# Altium schematic sheet GPIO_CAN.SchDoc
size A; SheetNumber: 9; SheetTotal: 10
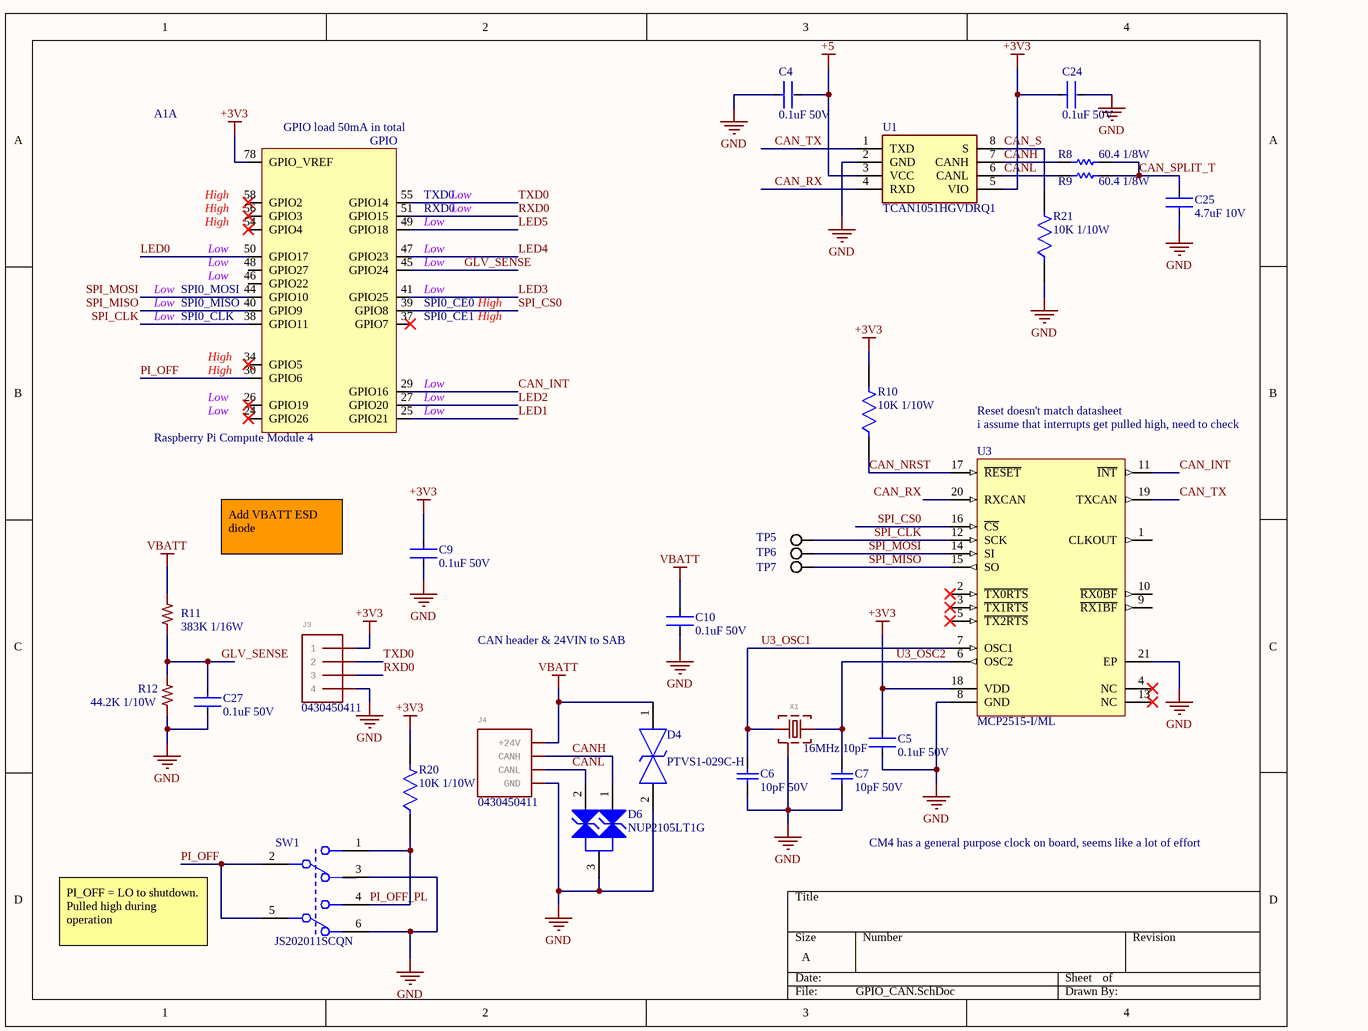
[diagram p0: GPIO_CAN.SchDoc]

## Parts
A1  Raspberry Pi Compute Module 4  [CM4-F40C-100DS-0.4v_1.5mm_0mm]  (part A of 21)  (no BOM)
C4  0.1uF 50V  [CAPACITOR_0603]
C5  0.1uF 50V  [CAPACITOR_0603]
C6  10pF 50V  [CAPC1608X90X40ML10T20]
C7  10pF 50V  [CAPC1608X90X40ML10T20]
C9  0.1uF 50V  [CAPACITOR_0603]
C10  0.1uF 50V  [CAPACITOR_0603]
C24  0.1uF 50V  [CAPACITOR_0603]
C25  4.7uF 10V  [CAPACITOR_0603]
C27  0.1uF 50V  [CAPACITOR_0603]
D4  PTVS1-029C-H  [PTVS1029CH]
D6  NUP2105LT1G  [ONSC-SOT-23-3-318-08_V]
J3  MPN: 0430450411  [43045-04YY_09101192]  (hidden comment: 4 Pin Connector)
J4  MPN: 0430450411  [43045-04YY_09101192]  (hidden comment: HyTech CAN Connector)
R8  60.4 1/8W  [RESC1608X55X30ML20T10]
R9  60.4 1/8W  [RESC1608X55X30ML20T10]
R10  10K 1/10W  [0603R]
R11  383K 1/16W  [0402R]
R12  44.2K 1/10W  [0402R]
R20  10K 1/10W  [0603R]
R21  10K 1/10W  [0603R]
SW1  JS202011SCQN  [FP-JS202011SCQN-MFG]
TP5  5019  [KSTN-5019_V]  (value not drawn)
TP6  5019  [KSTN-5019_V]  (value not drawn)
TP7  5019  [KSTN-5019_V]  (value not drawn)
U1  TCAN1051HGVDRQ1  [SOIC127P600X175-8N]
U3  MCP2515-I/ML  [QFN-ML20_L]
X1  16MHz 10pF  [XTAL_ECS-160-10-42-CKM-TR]

## Nets
+3V3: A1.78(GPIO_VREF) C5.2 C9.2 C24.2 J3.1 R10.2 R20.2 U1.5(VIO) U3.18(VDD)
+5: C4.1 U1.3(VCC)
GND: C4.2 C5.1 C6.1 C7.1 C9.1 C10.1 C24.1 C25.1 C27.1 D4.2 D6.3(K) J3.4 J4.2(GND) R12.1 R21.1 SW1.3 SW1.6 U1.2(GND) U3.8(GND) U3.21(EP) X1.2,4(GND)
VBATT: C10.2 D4.1 J4.1(+24V) R11.2
CAN_INT: A1.29(GPIO16) U3.11(~{INT})
CAN_NRST: R10.1 U3.17(~{RESET})
CAN_RX: U1.4(RXD) U3.20(RXCAN)
CAN_S: R21.2 U1.8(S)
CAN_SPLIT_T: C25.2 R8.2 R9.2
CAN_TX: U1.1(TXD) U3.19(TXCAN)
CANH: D6.1(K) J4.4(CANH) R8.1 U1.7(CANH)
CANL: D6.2(K) J4.3(CANL) R9.1 U1.6(CANL)
GLV_SENSE: A1.45(GPIO24) C27.2 R11.1 R12.2
LED0: A1.50(GPIO17)
LED1: A1.25(GPIO21)
LED2: A1.27(GPIO20)
LED3: A1.41(GPIO25)
LED4: A1.47(GPIO23)
LED5: A1.49(GPIO18)
PI_OFF: A1.30(GPIO6) SW1.2 SW1.5
PI_OFF_PL: R20.1 SW1.1 SW1.4
RXD0: A1.51(GPIO15) J3.3
SPI_CLK: A1.38(GPIO11) TP5.1 U3.12(SCK)
SPI_CS0: A1.39(GPIO8) U3.16(~{CS})
SPI_MISO: A1.40(GPIO9) TP7.1 U3.15(SO)
SPI_MOSI: A1.44(GPIO10) TP6.1 U3.14(SI)
TXD0: A1.55(GPIO14) J3.2
U3_OSC1: C6.2 U3.7(OSC1) X1.1
U3_OSC2: C7.2 U3.6(OSC2) X1.3

Not connected (* = marked no-connect by the designer): A1 24(GPIO26)* 26(GPIO19)* 34(GPIO5)* 37(GPIO7)* 46(GPIO22) 48(GPIO27) 54(GPIO4)* 56(GPIO3)* 58(GPIO2)*; U3 1(CLKOUT) 2(~{TX0RTS})* 3(~{TX1RTS})* 4(NC)* 5(~{TX2RTS})* 9(~{RX1BF}) 10(~{RX0BF}) 13(NC)*

## Notes on the sheet
- Reset doesn't match datasheet
- (near U3) i assume that interrupts get pulled high, need to check
- Add VBATT ESD diode
- (near C10) CAN header & 24VIN to SAB
- CM4 has a general purpose clock on board, seems like a lot of effort
- PI_OFF = LO to shutdown. Pulled high during operation
- (in symbol CM4, part A) GPIO load 50mA in total; GPIO; High; TXD0; Low; RXD0; SPI0_MOSI; SPI0_MISO; SPI0_CE0; SPI0_CLK; SPI0_CE1; by Amornthep Phunsin

## Library data of the parts
A1 = CM4: Raspberry Pi Compute Module 4 by Amornthep Phunsin; MPN: SC0695; MFR: Raspberry Pi
C4 C5 C9 C10 C24 C27 = CL10B104KB8NNWC: CAP CER 0.1UF 50V X7R 0603; MFR: Samsung Electro-Mechanics; MPN: CL10B104KB8NNWC
C6 C7 = CMP-2100-03593-1: Chip Capacitor, 10 pF, +/- 5%, 50 V, -55 to 125 degC, 0603 (1608 Metric), RoHS, Tape and Reel; Manufacturer: Yageo; MPN: CC0603JRNPO9BN100; Insulation Resistance: 100GR; Temperature Coefficient: 30ppm/degC; Dielectric: C0G; Radiation Hardening: No; Mount: SurfaceMount; Width: 0.031inch; Composition: Ceramic; Package Description: 2-Pin Surface Mount Device, Body 1.6 x 0.8 mm; Min Operating Temperature: -55degC; Case Code (Metric): 1608; Datasheet URL: http://www.yageo.com/documents/recent/UPY-GP_NP0_16V-to-50V_14.pdf; Voltage Rating: 50V; Termination: SMD/SMT; REACH SVHC: NoSVHC; Case/Package: 0603; RoHSCompliant: True; Packaging: TapeandReel; Max Operating Temperature: 125degC; Voltage: 50V; Package Quantity: 1; Manufacturer URL: http://www.yageo.com/; Tolerance: 5%; Capacitance: 10pF; Height: 0.8mm; Depth: 0.8mm; Thickness: 0.035inch; Case Code (Imperial): 0603; Length: 1.6mm; Package Reference: 0603; Voltage Rating (DC): 50V; Lead Free: LeadFree; Number of Pins: 2; Datasheet Version: Rev. 14, 07/2016; MFR: YAGEO
C25 = CL10A475KP8NNNC: CAP CER 4.7UF 10V X5R 0603; MFR: Samsung Electro-Mechanics; MPN: CL10A475KP8NNNC
D4 = PTVS1-029C-H: TVS Diode (Bi-directional); Manufacturer_Name: Bourns; Datasheet Link: https://g.componentsearchengine.com/Datasheets/0/16509875.pdf; Height: 2.6mm; Mouser Part Number: 652-PTVS1-029C-H; Mouser Price/Stock: https://www.mouser.co.uk/ProductDetail/Bourns/PTVS1-029C-H?qs=vvQtp7zwQdNgKzZ3txsBHg%3D%3D; Arrow Part Number: PTVS1-029C-H; MPN: PTVS1-029C-H; MFR: Bourns
D6 = NUP2105LT1G: Dual Line CAN Bus Protector, 3-Pin SOT-23, Pb-Free, Tape and Reel; MFR: On Semiconductor; IR Max (uA): 0.1; Number of Lines: 2; Direction: Bidirectional; PPK Max (W): 350; V(BR) Min (V): 26.2; ComponentLink3URL: http://www.onsemi.cn/pub_link/Collateral/318-08.PDF; Mounting Technology: Surface Mount; ComponentLink2Description: Datasheet; MPN: NUP2105LT1G; ComponentLink1URL: http://www.onsemi.com/; PackageVersion: Rev. AP, 11/2009; DatasheetVersion: Rev. 5; RoHS: Pb-Free; PackageReference: SOT-23-3-318-08; ComponentLink2URL: http://www.onsemi.cn/pub_link/Collateral/NUP2105L-D.PDF; ComponentLink1Description: Manufacturer URL; PackageDescription: 3-Pin Small Outline Transistor, Body 2.92 x 1.3 mm, Pitch 0.95 mm; Packing: Tape and Reel; ComponentLink3Description: Package Specification
J3 = CONNECTOR-4_?_*μF_S_RA: CONN HEADER SMD R/A 4POS 3MM; MANUFACTURER: Molex; GateName_1: G$1; SymbolName_1: CONNECTOR_04; DKPN: WM1832CT-ND; MOPN: 538-0430450411; DeviceName: μF_S_RA; LibraryName: HyTechDevices; DeviceSetName: CONNECTOR-4_?_*; Package: MOLEX_MICROFIT_SMD_RIGHTANGLE_04_DUAL; MFR: Molex
J4 = CONNECTOR-CAN_?_*μF_S_RA: CONN HEADER SMD R/A 4POS 3MM; MANUFACTURER: Molex; GateName_1: G$1; SymbolName_1: CONNECTOR_CAN; DKPN: WM1832CT-ND; MOPN: 538-43045-0411; DeviceName: μF_S_RA; LibraryName: HyTechDevices; DeviceSetName: CONNECTOR-CAN_?_*; Package: MOLEX_MICROFIT_SMD_RIGHTANGLE_04_DUAL; MFR: Molex
R8 R9 = CMP-2000-01611-1: RES SMD 60.4 OHM 1% 1/8W 0603; Manufacturer: KOA Speer; MPN: RK73H1JTTD60R4F; MFR: KOA Speer
R10 R20 R21 = ERJ-3EKF1002V: RES SMD 10K OHM 1% 1/10W 0603; MFR: Parasonic; MFR PN: ERJ-3EKF1002V; MPN: ERJ-3EKF1002V
R11 = RC0402FR-07383KL: RES SMD 383K OHM 1% 1/16W 0402; MANUFACTURER: YAGEO; GateName_1: G$1; SymbolName_1: RESISTOR; DeviceName: 0402; POWER: *; DPKN: *; MPN: RC0402FR-07383KL; VOLTAGE_CONTINUOUS: *; VOLTAGE_MAX: *; RESISTANCE: *; MFR: YAGEO
R12 = ERJ-2RKF4422X: RES SMD 44.2K OHM 1% 1/10W 0402; MANUFACTURER: Panasonic Electronic Components; GateName_1: G$1; SymbolName_1: RESISTOR; DeviceName: 0402; DPKN: *; MPN: ERJ-2RKF4422X; POWER: *; VOLTAGE_CONTINUOUS: *; VOLTAGE_MAX: *; RESISTANCE: *; MFR: Panasonic Electronic Components
SW1 = JS202011SCQN: SWITCH SLIDE DPDT 300MA 6V; MFR: C&K; Switch Function: On-On; Switch Travel: 2mm; Contact Resistance: 70mR; Electrical Life: 5000Cycles; REACH SVHC: No SVHC; Series: JS; Min Operating Temperature: -20°C; Depth: 7.5mm; Housing Material: Nylon; Voltage Rating (DC): 6V; Max Operating Temperature: 85°C; Contact Current Rating: 300mA; Package Quantity: 1; Contact Plating: Silver; Contact Material: Copper Alloy; Throw Configuration: DPDT; Current Rating: 300mA; Orientation: Vertical; Max Current Rating: 300mA; Max Voltage Rating (DC): 6V; Flammability Rating: UL94 V-2; Length: 9mm; Packaging: Tape and Reel; Mount: Surface Mount; Lead Free: Lead Free; Termination: Gull Wing; Radiation Hardening: No; MPN: JS202011SCQN
TP5-TP7 = CMP-1672-00008-1: Test Point, 1 Position SMD, RoHS, Tape and Reel; MFR: Keystone Electronics; ComponentLink1Description: Manufacturer URL; Package Quantity: 1000; DatasheetVersion: 03/2014; Packaging: Tape and Reel; ComponentLink2URL: http://www.keyelco.com/product-pdf.cfm?p=1357; ComponentLink1URL: http://www.keyelco.com/; Mount: Surface Mount; Contact Plating: Silver; PackageDescription: 1-Pin Surface Mount Device, Body 3.81 x 2.03 mm; Pins: 1; RoHSCompliant: True; Mounting Technology: Surface Mount; ComponentLink2Description: Datasheet; PackageReference: 5019; MPN: 5019
U1 = TCAN1051HGVDRQ1: IC TRANSCEIVER HALF 1/1 8SOIC; Manufacturer_Name: Texas Instruments; Datasheet Link: http://www.ti.com/lit/gpn/TCAN1051HGV-Q1; Height: 1.75mm; Mouser Part Number: 595-TCAN1051HGVDRQ1; Mouser Price/Stock: https://www.mouser.co.uk/ProductDetail/Texas-Instruments/TCAN1051HGVDRQ1?qs=dSktwyqbRaUv%252Bzz8wwNi2g%3D%3D; Arrow Part Number: TCAN1051HGVDRQ1; MPN: TCAN1051HGVDRQ1; MFR: Texas Instruments
U3 = CMP-0186-00187-1: Stand-Alone CAN Controller With SPI Interface, 20-Pin QFN, Industrial Temperature; MFR: Microchip Technology; DatasheetVersion: revF, Oct-2010; ComponentLink1URL: http://www.microchip.com/; ComponentLink3URL: http://www.microchip.com/stellent/groups/techpub_sg/documents/packagingspec/en012702.pdf; ComponentLink2Description: Datasheet; PackageDescription: 20-Lead Plastic Quad Flat, No Lead Package (ML) - 4x4x0.9 mm Body [QFN]; PackageVersion: revBB, Aug-2009; ComponentLink3Description: Package Specification; ComponentLink2URL: http://ww1.microchip.com/downloads/en/DeviceDoc/21801F.pdf; PackageReference: QFN-ML20; ComponentLink1Description: Manufacturer URL; MPN: MCP2515-I/ML
X1 = CRYSTAL_*: CRYSTAL 16.0000MHZ 10PF SMD; MANUFACTURER: TXC CORPORATION; MPN: ECS-160-10-42-CKM-TR; GateName_1: G$1; DKPN: XC2566CT-ND; MOPN: 520-160-10-42-CKMT; SHUNT_CAPACITANCE: 2 - 5 pF; SymbolName_1: CRYSTAL; LibraryName: HyTechDevices; DeviceSetName: CRYSTAL_*; Package: ECX-42; FREQUENCY: 16 MHz; LOAD_CAPACITANCE: 10pF; MFR: TXC CORPORATION